# EAGLE schematic Power Board rev2 (EAGLE 7.7.0)
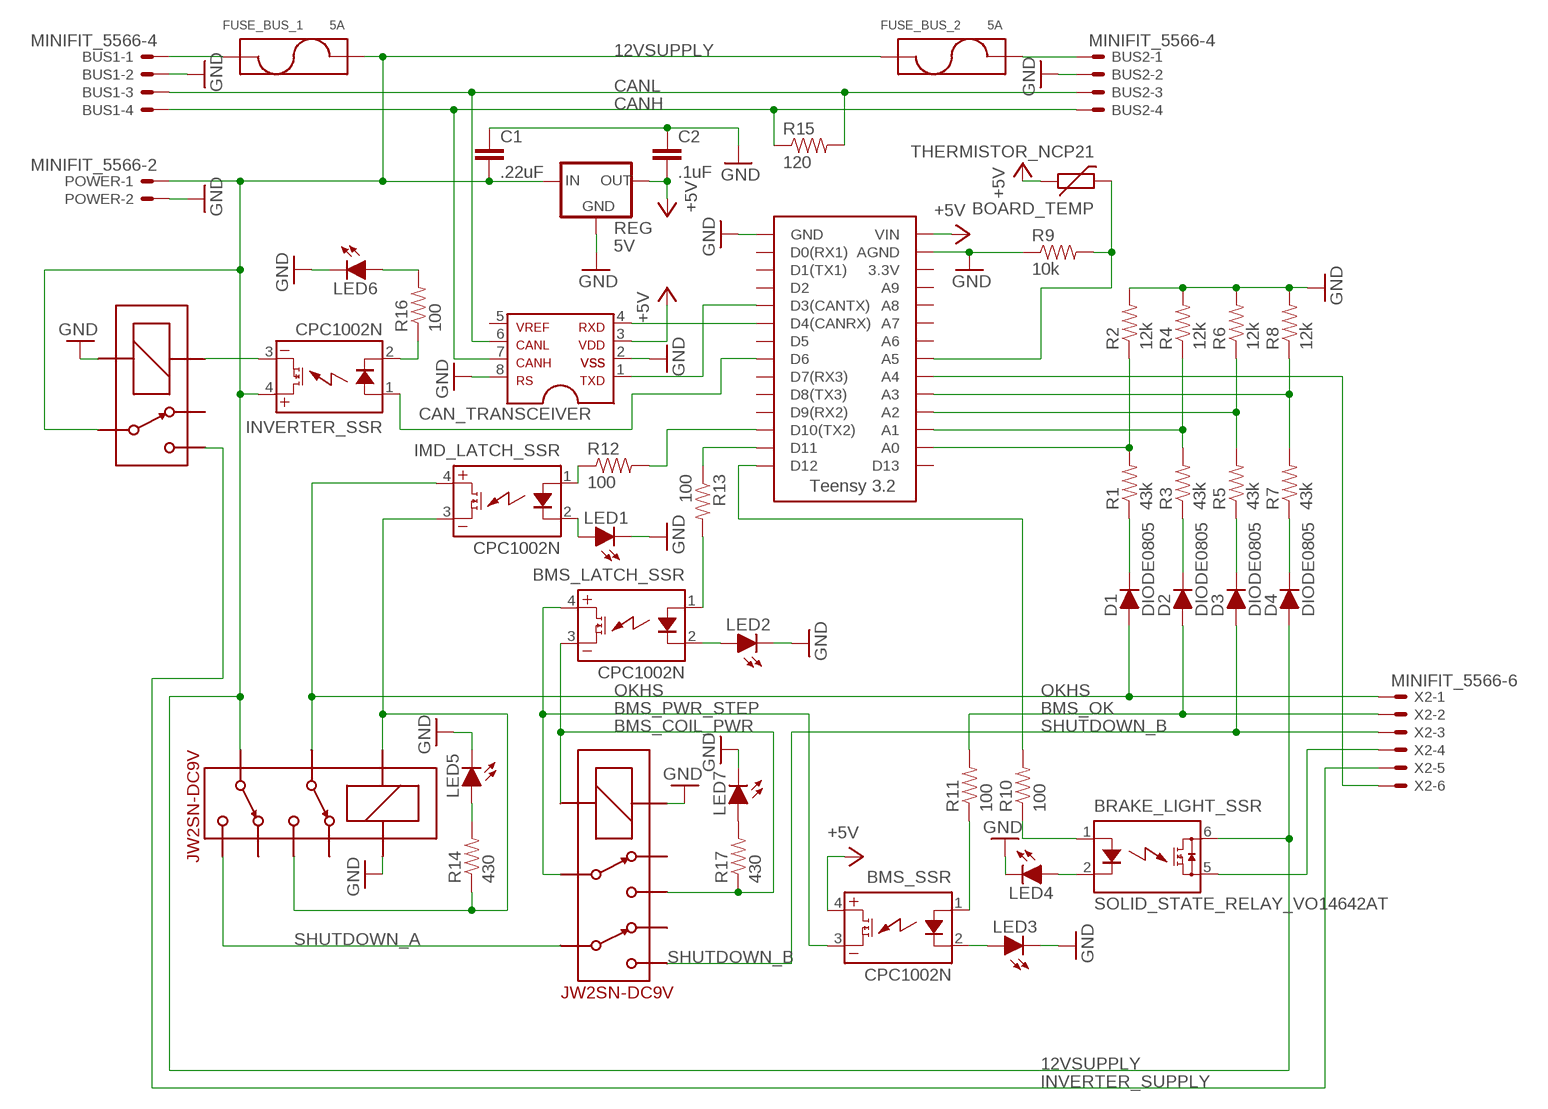
[diagram p0: schematic, sheet 1]

## Parts
BMS_LATCH_SSR  CPC1002N  [SOP04]
BMS_SSR  CPC1002N  [SOP04]
BOARD_TEMP  THERMISTOR_NCP21  [0805]
BRAKE_LIGHT_SSR  SOLID_STATE_RELAY_VO14642AT  [DIL06]
BUS1  MINIFIT_5566-4  [MINIFIT_5566-4]
BUS2  MINIFIT_5566-4  [MINIFIT_5566-4]
C1  .22uF  CAP0805  [0805]
C2  .1uF  CAP0805  [0805]
CAN_TRANSCEIVER  MCP2551  [SOIC-08]
D1  DIODE0805  [0805_D]
D2  DIODE0805  [0805_D]
D3  DIODE0805  [0805_D]
D4  DIODE0805  [0805_D]
FUSE_BUS_1  5A  FUSE_HOLDER  [FUSE_HOLDER]
FUSE_BUS_2  5A  FUSE_HOLDER  [FUSE_HOLDER]
IMD_LATCH_SSR  CPC1002N  [SOP04]
IMD_SHUTDOWN  DPDT_RELAY_PANASONIC_JW2SN-DC9V  [DPDT_RELAY_PANASONIC_JW2SN]
IMD_SHUTDOWN1  DPDT_RELAY_PANASONIC_JW2SN-DC9V  [DPDT_RELAY_PANASONIC_JW2SN]
INVERTER_SSR  CPC1002N  [SOP04]
LED1  LED-0805  [LED-805]
LED2  LED-0805  [LED-805]
LED3  LED-0805  [LED-805]
LED4  LED-0805  [LED-805]
LED5  LED-0805  [LED-805]
LED6  LED-0805  [LED-805]
LED7  LED-0805  [LED-805]
POWER  MINIFIT_5566-2  [MINIFIT_5566-2]
R1  43k  RESISTOR0805-RES  [0805]
R2  12k  RESISTOR0805-RES  [0805]
R3  43k  RESISTOR0805-RES  [0805]
R4  12k  RESISTOR0805-RES  [0805]
R5  43k  RESISTOR0805-RES  [0805]
R6  12k  RESISTOR0805-RES  [0805]
R7  43k  RESISTOR0805-RES  [0805]
R8  12k  RESISTOR0805-RES  [0805]
R9  10k  RESISTOR0805-RES  [0805]
R10  100  RESISTOR0805-RES  [0805]
R11  100  RESISTOR0805-RES  [0805]
R12  100  RESISTOR0805-RES  [0805]
R13  100  RESISTOR0805-RES  [0805]
R14  430  RESISTOR0805-RES  [0805]
R15  120  RESISTOR0805-RES  [0805]
R16  100  RESISTOR0805-RES  [0805]
R17  430  RESISTOR0805-RES  [0805]
REG  5V  5V_REGULATOR_LM340-NLM340MPX-5.0/NOPB  [SOT223]
U$1  ORWH-SH-112D1F  [ZF112]
U$3  TEENSY_3.2_SIMPLE  [TEENSY_3.2_SIMPLE]
X2  MINIFIT_5566-6  [MINIFIT_5566-6]

## Nets
12VSUPPLY: BRAKE_LIGHT_SSR.6(IO1) C1.2 D4.A FUSE_BUS_1.R1 FUSE_BUS_1.R2 FUSE_BUS_2.L1 FUSE_BUS_2.L2 IMD_SHUTDOWN.6 INVERTER_SSR.4(DC+) POWER.1 REG.1(IN) U$1.P
12VSUPPLY_READ: R7.2 R8.1 U$3.A3
+5V: BMS_SSR.4(DC+) BOARD_TEMP.1 C2.2 CAN_TRANSCEIVER.3 REG.3(OUT) U$3.VIN
BMS_COIL_PWR: BMS_LATCH_SSR.3(DC-) IMD_SHUTDOWN1.4 IMD_SHUTDOWN1.COIL- R17.1
BMS_OK: D2.A R11.2 X2.2
BMS_OK_READ: R3.2 R4.1 U$3.A1
BMS_PWR_STEP: BMS_LATCH_SSR.4(DC+) BMS_SSR.3(DC-) IMD_SHUTDOWN1.3
CANH: BUS1.4 BUS2.4 CAN_TRANSCEIVER.7 R15.1
CANL: BUS1.3 BUS2.3 CAN_TRANSCEIVER.6 R15.2
GND: BUS1.2 BUS2.2 C1.1 C2.1 CAN_TRANSCEIVER.2 CAN_TRANSCEIVER.8 IMD_SHUTDOWN1.COIL+ IMD_SHUTDOWN.COIL+ LED1.C LED2.C LED3.C LED4.C LED5.C LED6.C LED7.C POWER.2 R2.2 R4.2 R6.2 R8.2 R9.1 REG.2(GND) REG.4(GND) U$1.2(COIL-) U$3.AGND U$3.GND
INVERTER_SUPPLY: U$1.S X2.5
N$1: IMD_LATCH_SSR.2(CONTROL-) LED1.A
N$2: CAN_TRANSCEIVER.4 U$3.D4(CANRX)
N$3: CAN_TRANSCEIVER.1 U$3.D3(CANTX)
N$4: BRAKE_LIGHT_SSR.5(IO2) X2.4
N$5: IMD_LATCH_SSR.1(CONTROL+) R12.1
N$6: IMD_LATCH_SSR.3(DC-) IMD_SHUTDOWN.4 IMD_SHUTDOWN.COIL- R14.1
N$7: BRAKE_LIGHT_SSR.2(LED-) LED4.A
N$8: R12.2 U$3.D10(TX2)
N$9: BMS_SSR.2(CONTROL-) LED3.A
N$10: BUS1.1 FUSE_BUS_1.L1 FUSE_BUS_1.L2
N$11: BUS2.1 FUSE_BUS_2.R1 FUSE_BUS_2.R2
N$12: BMS_LATCH_SSR.1(CONTROL+) R13.2
N$13: R10.2 U$3.D12
N$14: R13.1 U$3.D11
N$15: BOARD_TEMP.2 R9.2 U$3.A5
N$16: BMS_LATCH_SSR.2(CONTROL-) LED2.A
N$17: BRAKE_LIGHT_SSR.1(LED+) R10.1
N$18: BMS_SSR.1(CONTROL+) R11.1
N$19: LED5.A R14.2
N$20: U$3.A4 X2.6
N$21: INVERTER_SSR.1(CONTROL+) U$3.D6
N$22: D1.C R1.1
N$23: D2.C R3.1
N$24: D3.C R5.1
N$25: D4.C R7.1
N$26: INVERTER_SSR.3(DC-) U$1.1(COIL+)
N$27: INVERTER_SSR.2(CONTROL-) R16.1
N$28: LED6.A R16.2
N$32: LED7.A R17.2
OKHS: D1.A IMD_LATCH_SSR.4(DC+) IMD_SHUTDOWN.3 X2.1
OKHS_READ: R1.2 R2.1 U$3.A0
SHUTDOWN_A: IMD_SHUTDOWN1.6 IMD_SHUTDOWN.5
SHUTDOWN_B: D3.A IMD_SHUTDOWN1.5 X2.3
SHUTDOWN_OUT_READ: R5.2 R6.1 U$3.A2
Unconnected: CAN_TRANSCEIVER.5 IMD_SHUTDOWN1.2 IMD_SHUTDOWN1.7 IMD_SHUTDOWN.2 IMD_SHUTDOWN.7 U$1.O U$3.3.3V U$3.A6 U$3.A7 U$3.A8 U$3.A9 U$3.D0(RX1) U$3.D1(TX1) U$3.D2 U$3.D5 U$3.D7(RX3) U$3.D8(TX3) U$3.D9(RX2) U$3.D13

## Library data of the parts
BMS_LATCH_SSR BMS_SSR IMD_LATCH_SSR INVERTER_SSR = HyTechDevices:CPC1002N: IXYS Solid State Relay .7A
BOARD_TEMP = HyTechDevices:THERMISTOR_NCP21: Murata NCP21 10k Thermistor Datasheet <http://www.murata.com/~/media/webrenewal/support/library/catalog/products/thermistor/ntc/r44e.ashx>
BRAKE_LIGHT_SSR = HyTechDevices:SOLID_STATE_RELAY
BUS1 BUS2 = HyTechDevices:MINIFIT_5566-4: Mini-Fit Junior connector 4 pole Source: http://www.molex.com; OC_FARNELL: unknown; OC_NEWARK: unknown
C1 C2 = HyTechDevices:CAP: Capacitor Standard 0603 ceramic capacitor, and 0.1" leaded capacitor.
CAN_TRANSCEIVER = HyTechDevices:MCP2551: MCP2551 High-Speed CAN Transceiver Product Webpage <https://www.microchip.com/wwwproducts/en/MCP2551> Datasheet <http://ww1.microchip.com/downloads/en/DeviceDoc/21667f.pdf> This device is outdated It is replaced by MCP2561. Comparison Page <https://www.microchip.com/wwwproducts/ProductCompare/MCP2551/MCP2561> Product Webpage <https://www.microchip.com/wwwproducts/en/MCP2561> Datasheet <http://ww1.microchip.com/downloads/en/DeviceDoc/20005167C.pdf>
D1-D4 = HyTechDevices:DIODE: DIODE general purpose rectifier
FUSE_BUS_1 FUSE_BUS_2 = HyTechDevices:FUSE_HOLDER: Keystone Electronics 3568 Fuse Mouser Part <http://www.mouser.com/ProductDetail/Keystone-Electronics/3568> Datasheet <http://www.mouser.com/ds/2/215/568-742601.pdf>
IMD_SHUTDOWN IMD_SHUTDOWN1 = HyTechDevices:DPDT_RELAY_PANASONIC_JW2SN-DC9V: Double Pull Double Throw Relay 9VDC Datasheet <http://www.mouser.com/ds/2/316/jw-catalog-461998.pdf> Product Page <http://www.mouser.com/ProductDetail/Panasonic-Industrial-Devices/JW2SN-DC9V>
LED1-LED7 = HyTechDevices:LED: Light Emitting Diode (LED) Source: Dangerous Prototypes Eagle Library <https://github.com/DangerousPrototypes/Eagle_Part_Library>
POWER = HyTechDevices:MINIFIT_5566-2: Mini-Fit Junior connector 2 pole Source: http://www.molex.com; OC_FARNELL: 1822072; OC_NEWARK: unknown
R1-R17 = HyTechDevices:RESISTOR: Resistor Basic schematic elements and footprints for 0603, 1206, and PTH resistors.
REG = HyTechDevices:5V_REGULATOR_LM340-N: Voltage Regulator 5v linear voltage regulator Datasheet <http://www.mouser.com/ProductDetail/Texas-Instruments/LM340MPX-50-NOPB/?qs=X1J7HmVL2ZGZwtTFRQ9ItA%3D%3D> MAX current out: 1.5A MAX voltage in: 35V
U$1 = HyTechDevices:ORWH-SH-112D1F: TE SPST relay
U$3 = HyTechDevices:TEENSY_3.2_SIMPLE: Simple version of the Teensy 3.2 board that only uses the 2 main rows of pins, not the inner pins or the pins opposite the usb port.
X2 = HyTechDevices:MINIFIT_5566-6: Mini-Fit Junior connector 6 pole Source: http://www.molex.com; MPN: 95566-61002; OC_FARNELL: unknown; OC_NEWARK: 22K8620